# EAGLE design Decodificador de ppm (EAGLE 9.6.2)
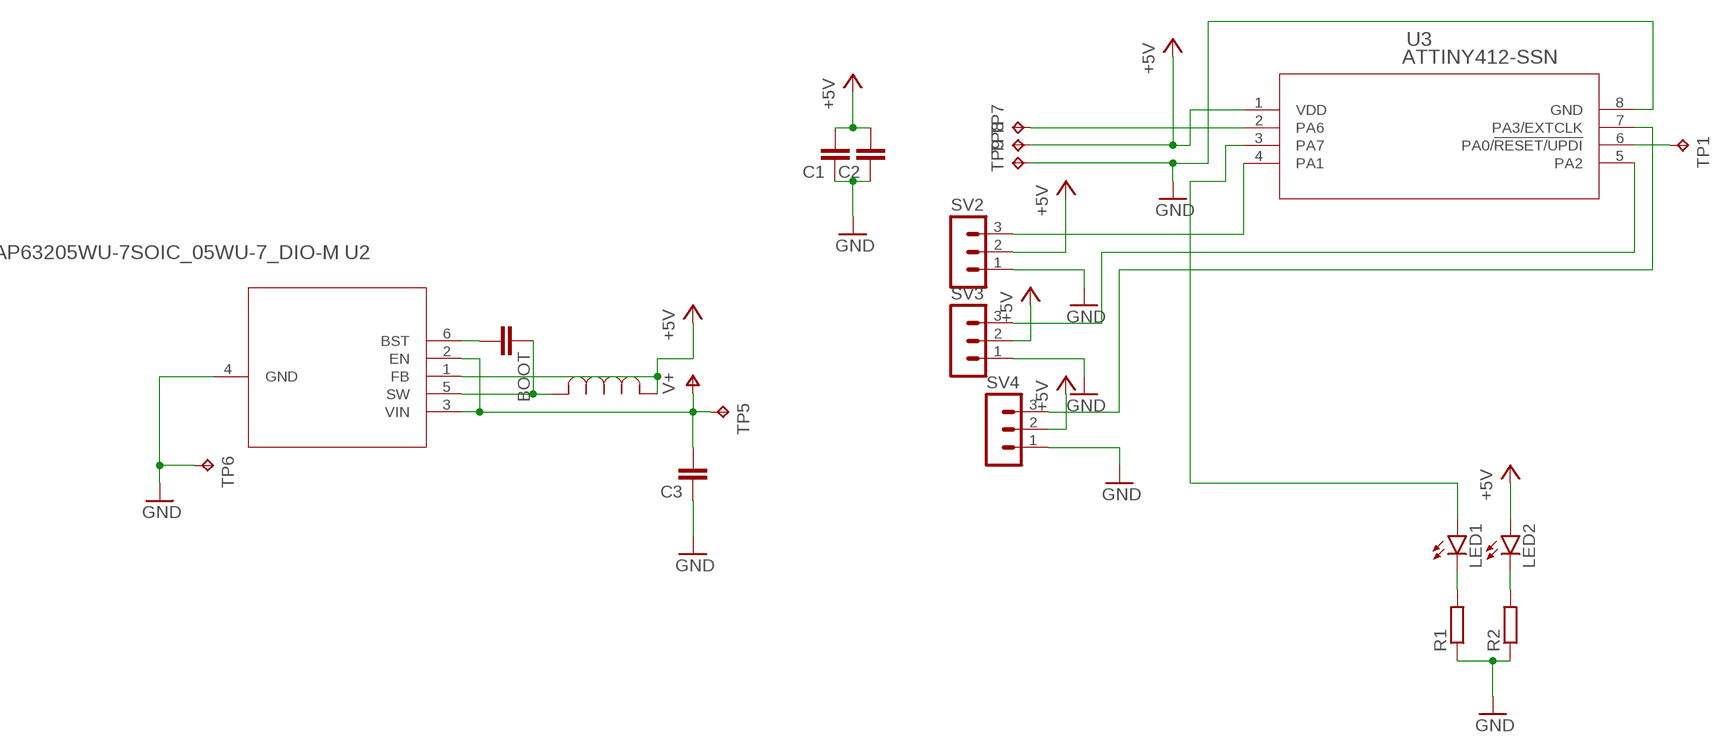
[diagram p0: schematic, sheet 1]

## Parts
BOOT  C-EUC0402  [C0402]
C1  C-EUC0805  [C0805]
C2  C-EUC0805  [C0805]
C3  C-EUC0805  [C0805]
LED1  LEDCHIP-LED0603  [CHIP-LED0603]
LED2  LEDCHIP-LED0603  [CHIP-LED0603]
R1  R-EU_R0805  [R0805]
R2  R-EU_R0805  [R0805]
SV2  MA03-1  [MA03-1]
SV3  MA03-1  [MA03-1]
SV4  MA03-1  [MA03-1]
TP1  TPB1,27  [B1,27]
TP5  TPTP19SQ  [TP19SQ]
TP6  TPTP19SQ  [TP19SQ]
TP7  TPTP19SQ  [TP19SQ]
TP8  TPTP19SQ  [TP19SQ]
TP9  TPTP19SQ  [TP19SQ]
U2  AP63205WU-7SOIC_05WU-7_DIO-M  [SOIC_05WU-7_DIO-M]
U3  ATTINY412-SSN  [SOIC8_SA_SST_MCH]
U$2  INDUCTOR4.7  [IND_NRS5030T100MMGJ_TAY]

## Nets
+5V: C1.2 C2.2 LED2.A SV2.2 SV3.2 SV4.2 TP8.TP U2.1(FB) U3.1(VDD) U$2.1
GND: C1.1 C2.1 C3.1 R1.1 R2.1 SV2.1 SV3.1 SV4.1 TP6.TP TP9.TP U2.4(GND) U3.8(GND)
N$1: LED1.C R1.2
N$2: LED2.C R2.2
N$3: TP7.TP U3.2(PA6)
N$4: TP1.TP U3.6(PA0/!RESET/UPDI)
N$7: SV2.3 U3.4(PA1)
N$8: SV3.3 U3.5(PA2)
N$9: SV4.3 U3.7(PA3/EXTCLK)
N$13: LED1.A U3.3(PA7)
N$17: BOOT.1 U2.5(SW) U$2.2
N$18: BOOT.2 U2.6(BST)
V+: C3.2 TP5.TP U2.2(EN) U2.3(VIN)

## Library data of the parts
BOOT C1-C3 = rcl:C-EU: CAPACITOR, European symbol; SPICEPREFIX: C
LED1 LED2 = led:LED: LED OSRAM: - CHIPLED LG R971, LG N971, LY N971, LG Q971, LY Q971, LO R971, LY R971 LH N974, LH R974 LS Q976, LO Q976, LY Q976 LO Q996 - Hyper CHIPLED LW Q18S LB Q993, LB Q99A, LB R99A - SideLED LS A670, LO A670, LY A670, LG A670, LP A670 LB A673, LV A673, LT A673, LW A673 LH A674 LY A675 LS A676, LA A676, LO A676, LY A676, LW A676 LS A679, LY A679, LG A679 - Hyper Micro SIDELED® LS Y876, LA Y876, LO Y876, LY Y876 LT Y87S - SmartLED LW L88C, LW L88S LB L89C, LB L89S, LG L890 LS L89K, LO L89K, LY L89K LS L896, LA L896, LO L896, LY L896 - TOPLED LS T670, LO T670, LY T670, LG T670, LP T670 LSG T670, LSP T670, LSY T670, LOP T670, LYG T670 LG T671, LOG T671, LSG T671 LB T673, LV T673, LT T673, LW T673 LH T674 LS T676, LA T676, LO T676, LY T676, LB T676, LH T676, LSB T676, LW T676 LB T67C, LV T67C, LT T67C, LS T67K, LO T67K, LY T67K, LW E67C LS E67B, LA E67B, LO E67B, LY E67B, LB E67C, LV E67C, LT E67C LW T67C LS T679, LY T679, LG T679 LS T770, LO T770, LY T770, LG T770, LP T770 LB T773, LV T773, LT T773, LW T773 LH T774 LS E675, LA E675, LY E675, LS T675 LS T776, LA T776, LO T776, LY T776, LB T776 LHGB T686 LT T68C, LB T68C - Hyper Mini TOPLED® LB M676 - Mini TOPLED Santana® LG M470 LS M47K, LO M47K, LY M47K Source: http://www.osram.convergy.de LUXEON: - LUMILED® LXK2-PW12-R00, LXK2-PW12-S00, LXK2-PW14-U00, LXK2-PW14-V00 LXK2-PM12-R00, LXK2-PM12-S00, LXK2-PM14-U00 LXK2-PE12-Q00, LXK2-PE12-R00, LXK2-PE12-S00, LXK2-PE14-T00, LXK2-PE14-U00 LXK2-PB12-K00, LXK2-PB12-L00, LXK2-PB12-M00, LXK2-PB14-N00, LXK2-PB14-P00, LXK2-PB14-Q00 LXK2-PR12-L00, LXK2-PR12-M00, LXK2-PR14-Q00, LXK2-PR14-R00 LXK2-PD12-Q00, LXK2-PD12-R00, LXK2-PD12-S00 LXK2-PH12-R00, LXK2-PH12-S00 LXK2-PL12-P00, LXK2-PL12-Q00, LXK2-PL12-R00 Source: www.luxeon.com KINGBRIGHT: KA-3528ASYC Source: www.kingbright.com
R1 R2 = rcl:R-EU_: RESISTOR, European symbol; SPICEPREFIX: R
SV2-SV4 = con-lstb:MA03-1: PIN HEADER; OC_FARNELL: unknown; OC_NEWARK: unknown
TP1 TP5-TP9 = testpad:TP: Test pad
U2 = AP63205WU-7:AP63205WU-7; BUILT_BY: EMA_Matt; COPYRIGHT: Copyright (C) 2018 Accelerated Designs. All rights reserved; MANUFACTURER_PART_NUMBER: AP63205WU-7; SOURCELIBRARY: Diodes_Inc_2019-12-05; VENDOR: Diodes Inc
U3 = attiny412:ATTINY412-SSN; BUILT_BY: EMA_Molly; COPYRIGHT: Copyright (C) 2018 Accelerated Designs. All rights reserved; MANUFACTURER_PART_NUMBER: ATTINY412-SSN; SOURCELIBRARY: Microchip_2019-08-23_25; VENDOR: Microchip
U$2 = Inductor4.7:INDUCTOR4.7

## Board
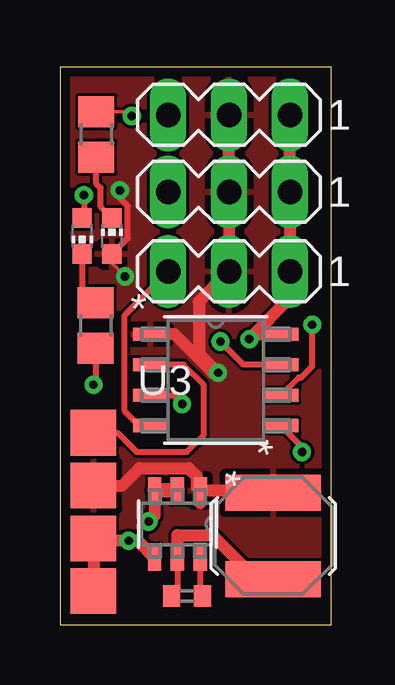
[diagram p1: board, top side]
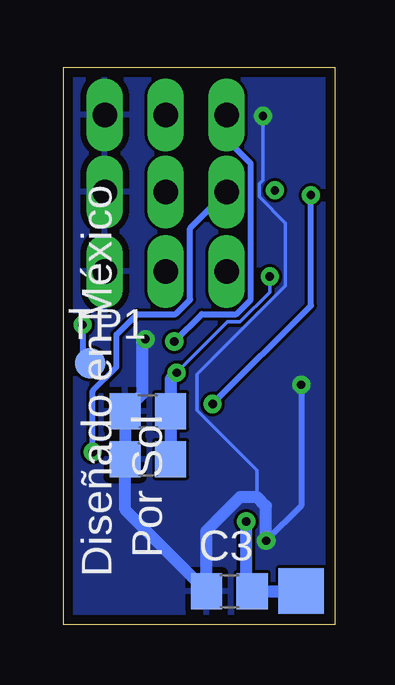
[diagram p2: board, bottom side, seen from below]

Size 11.32 x 23.24 mm. Coordinates in mm from the lower left corner, seen from the top.
Outline: 0,0 11.32,0 11.32,23.24 0,23.24 0,0
Copper layers (1*16): Top 0.035mm / dielectric 1.5mm / Bottom 0.035mm
Design rules "default *": minimum track width 6mil, minimum drill 0.35mm, track to track 5mil, track to pad 5mil, pad to pad 5mil, via to via 6mil, smd to smd 5mil, copper to edge 0.4mm, drill to drill 6mil, minimum pad ring 10mil, minimum via ring 8mil, stop-mask expansion 4mil, vias tented up to drill 0mil, thermal gap 10mil

### Footprints (pad centres in the part's own frame; a part is rotated, then mirrored left to right if it is on the bottom)
C0402 = smd 0.7 x 0.9: 1 -0.65,0; 2 0.65,0
C0805 = smd 1.3 x 1.5: 1 -0.95,0; 2 0.95,0
CHIP-LED0603 = smd 0.8 x 0.8: A 0,-0.75; C 0,0.75
R0805 = smd 1.3 x 1.5: 1 -0.95,0; 2 0.95,0
MA03-1 = drill 1.016 long: 1 -2.54,0; 2 0,0; 3 2.54,0
B1,27 = smd 1.27 x 1.27: TP 0,0
TP19SQ = smd 1.9 x 1.9: TP 0,0
SOIC_05WU-7_DIO-M = smd 1.096 x 0.557: 1 -1.399,0.95; 2 -1.399,0; 3 -1.399,-0.95; 4 1.399,-0.95; 5 1.399,0; 6 1.399,0.95
SOIC8_SA_SST_MCH = smd 1.455 x 0.558: 1 -2.721,1.905; 2 -2.721,0.635; 3 -2.721,-0.635; 4 -2.721,-1.905; 5 2.721,-1.905; 6 2.721,-0.635; 7 2.721,0.635; 8 2.721,1.905
IND_NRS5030T100MMGJ_TAY = smd 1.499 x 3.988: 1 -1.8,0; 2 1.8,0

### Placement (x,y rotation side)
BOOT  5.3,1.2 0 top
C1  7.8,6.9 0 bottom
C2  7.8,8.9 0 bottom
C3  4.4,1.4 0 bottom
LED1  0.93,16.2 180 top
LED2  2.17,16.2 0 top
R1  1.49,12.47 90 top
R2  1.52,20.43 270 top
SV2  7.06,14.73 180 top
SV3  7.06,18.04 180 top
SV4  7.06,21.25 180 top
TP1  10.2,10.9 0 bottom
TP5  1.4,1.4 0 bottom
TP6  1.4,1.4 0 top
TP7  1.4,8 0 top
TP8  1.4,5.8 0 top
TP9  1.4,3.6 0 top
U2  4.9,4.2 270 top
U3  6.5,10.2 0 top
U$2  8.9,3.7 270 top

### Tracks (layer width: path | path; a pad name or v marks a point on that pad's centre or on a via)
+5V  (via drill 0.35)
  Top 0.152: v2.71,14.51 2.17,15.06 LED2.A
  Top 0.254: 5.95,5.5 U2.1 | U$2.1 9.7,5.5 | v2.5,18.1 2.5,17.78 2.82,17.45 2.82,16.1 LED2.A
  Top 0.508: U2.1 8.8,5.6 U$2.1 | SV4.2 SV3.2 SV2.2 5.8,13.47 5.8,11.3 v6.6,10.5 6.38,10.5 4.78,12.11 U3.1 | 1.9,5.5 TP8.TP 2.59,5.8 3.31,6.53 5.37,6.53 5.7,6.2 5.7,5.75 U2.1 | U2.1 5.85,5.08
  Bottom 0.152: v6.6,10.5 4.48,12.62 3.96,12.62 2.71,13.86 v2.71,14.51
  Bottom 0.508: C1.2 C2.2 6.85,10.25 v6.6,10.5
  pour Top: 0,0 0,23.2 11.4,23.2 11.4,0
GND  (via drill 0.35)
  Top 0.152: R2.1 2.82,21.38 v3,21.2
  Top 0.254: R1.1 1.49,10.09 v1.4,10
  Top 0.305: 1.44,1.44 TP6.TP
  Top 0.508: SV4.1 SV3.1 SV2.1 9.6,13.6 v7.9,11.9 8.11,12.11 U3.8 | 1.65,1.4 TP6.TP | TP9.TP 1.4,3.5 | 1.4,3.5 TP6.TP | TP6.TP 1.9,1.4 | U2.4 3.25,3.5 v2.87,3.5 1.4,3.5
  Bottom 0.152: v3,21.2 3,18.52 3.15,18.37 3.15,17.83 2.06,16.73 2.06,14.12 5.75,10.43 5.75,8.93 3.25,6.43 3.25,5.33
  Bottom 0.254: v1.4,10 1.4,4.97 v2.87,3.5
  Bottom 0.508: C3.1 5.38,1.43 | 5.38,1.43 8.75,4.8 C1.1 C2.1 8.05,9.6 8.05,11.75 v7.9,11.9 | v2.87,3.5 2.87,4.95 3.25,5.33 3.94,5.33 5.38,3.9 5.38,1.43
  pour Bottom: 0,0 0,23.2 11.4,23.2 11.4,0
N$1
  Top 0.254: LED1.C 0.93,13.98 R1.2
N$2
  Top 0.254: R2.2 1.52,18.38 1.71,18.19 1.71,17.41 LED2.C
N$3
  Top 0.254: TP7.TP 2.4,8 3.2,7.2 5.3,7.2 6,7.9 6,10 5.17,10.84 U3.2
N$4  (via drill 0.35)
  Top 0.254: U3.6 9.96,10.3 10.05,10.3 10.53,10.78 v10.53,12.5
  Bottom 0.254: v10.53,12.5 10.53,11.23 TP1.TP
N$7
  Top 0.254: U3.4 3.31,8.29 2.7,8.9 2.7,12.9 4.52,14.72 SV2.3
N$8  (via drill 0.35)
  Top 0.254: U3.5 10.1,7.42 v10.1,7.2
  Bottom 0.254: v10.1,7.2 10.1,9.74 9.11,10.73 9.11,12.09 8.25,12.95 6.64,12.95 6.04,13.54 6.04,16.51 SV3.3
N$9  (via drill 0.35)
  Top 0.254: U3.7 7.67,10.84 v6.7,11.8
  Bottom 0.254: v6.7,11.8 5.55,12.95 4.1,12.95 3.5,13.54 3.5,19.22 4.52,20.23 SV4.3
N$13  (via drill 0.35)
  Top 0.254: U3.3 4.74,9.56 v5.1,9.2 | v1,17.9 1,17.02 LED1.A
  Bottom 0.254: v5.1,9.2 1,13.3 v1,17.9
N$17
  Top 0.254: U2.5 4.9,1.45 BOOT.1
  Top 0.508: U2.5 4.9,3.73 6.37,3.73 8.2,1.9 U$2.2
N$18
  Top 0.254: BOOT.2 5.85,1.3 U2.6
V+  (via drill 0.35)
  Top 0.508: U2.3 3.95,4.55 v3.7,4.3
  Top 0.61: U2.2 U2.3
  Bottom 0.508: TP5.TP C3.2 3.7,1.65 v3.7,4.3

### Text on the board
bNames: Por Sol | Diseñado en México